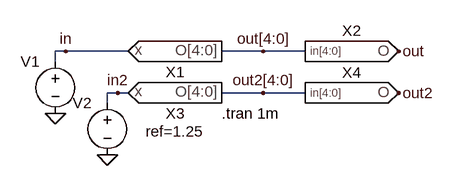
[diagram p0: schematic test-adc-5bit-fast.asc]
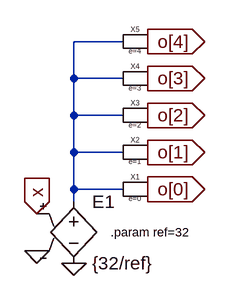
[diagram p1: sub-circuit adc-5bit-fast.asc]
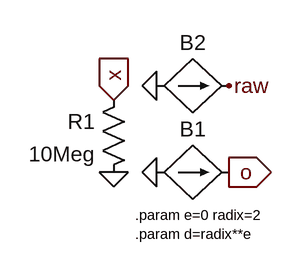
[diagram p2: sub-circuit adc_bit_extract.asc]
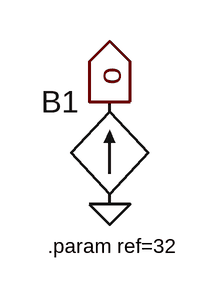
[diagram p3: sub-circuit dac-5bit-fast.asc]
test-adc-5bit-fast.asc, the LTspice schematic file:
Version 4
SHEET 1 880 680
WIRE 128 160 112 160
WIRE 224 160 128 160
WIRE 432 160 368 160
WIRE 496 160 432 160
WIRE 112 176 112 160
WIRE 208 224 192 224
WIRE 224 224 208 224
WIRE 432 224 368 224
WIRE 496 224 432 224
WIRE 192 240 192 224
FLAG 640 160 out
FLAG 128 160 in
FLAG 112 256 0
FLAG 640 224 out2
FLAG 432 160 out[4:0]
FLAG 432 224 out2[4:0]
FLAG 208 224 in2
FLAG 192 320 0
SYMBOL voltage 112 160 M0
WINDOW 3 24 96 Invisible 2
WINDOW 123 0 0 Left 0
WINDOW 39 0 0 Left 0
SYMATTR Value SINE(16 16 1k)
SYMATTR InstName V1
SYMBOL adc-5bit-fast 304 160 R0
SYMATTR InstName X1
SYMBOL adc-5bit-fast 304 224 R0
WINDOW 39 -8 44 Top 2
SYMATTR InstName X3
SYMATTR SpiceLine ref=1.25
SYMBOL dac-5bit-fast 560 160 R0
SYMATTR InstName X2
SYMBOL dac-5bit-fast 560 224 R0
SYMATTR InstName X4
SYMBOL voltage 192 224 M0
WINDOW 3 24 96 Invisible 2
WINDOW 123 0 0 Left 0
WINDOW 39 0 0 Left 0
SYMATTR Value SINE(0.625 0.625 1k)
SYMATTR InstName V2
TEXT 368 256 Left 2 !.tran 1m

adc-5bit-fast.asc, the sub-circuit schematic file:
Version 4
SHEET 1 880 680
WIRE 176 -224 112 -224
WIRE 112 -176 112 -224
WIRE 176 -176 112 -176
WIRE 112 -128 112 -176
WIRE 176 -128 112 -128
WIRE 112 -80 112 -128
WIRE 176 -80 112 -80
WIRE 112 -32 112 -80
WIRE 176 -32 112 -32
WIRE 112 -16 112 -32
FLAG 208 -32 o[0]
IOPIN 208 -32 Out
FLAG 64 0 x
IOPIN 64 0 In
FLAG 64 48 0
FLAG 112 64 0
FLAG 208 -80 o[1]
IOPIN 208 -80 Out
FLAG 208 -128 o[2]
IOPIN 208 -128 Out
FLAG 208 -176 o[3]
IOPIN 208 -176 Out
FLAG 208 -224 o[4]
IOPIN 208 -224 Out
SYMBOL adc_bit_extract 192 -32 R0
WINDOW 39 0 19 Bottom 0
SYMATTR InstName X1
SYMATTR SpiceLine e=0
SYMBOL e 112 -32 R0
SYMATTR InstName E1
SYMATTR Value {32/ref}
SYMBOL adc_bit_extract 192 -80 R0
WINDOW 39 0 19 Bottom 0
SYMATTR InstName X2
SYMATTR SpiceLine e=1
SYMBOL adc_bit_extract 192 -128 R0
WINDOW 39 0 19 Bottom 0
SYMATTR InstName X3
SYMATTR SpiceLine e=2
SYMBOL adc_bit_extract 192 -176 R0
WINDOW 39 0 19 Bottom 0
SYMATTR InstName X4
SYMATTR SpiceLine e=3
SYMBOL adc_bit_extract 192 -224 R0
WINDOW 39 0 19 Bottom 0
SYMATTR InstName X5
SYMATTR SpiceLine e=4
TEXT 160 24 Left 1 !.param ref=32

adc_bit_extract.asc, the sub-circuit schematic file:
Version 4
SHEET 1 880 680
FLAG 256 208 o
IOPIN 256 208 Out
FLAG 176 208 0
FLAG 128 208 0
FLAG 128 128 x
IOPIN 128 128 In
FLAG 256 112 raw
FLAG 176 112 0
SYMBOL bi 176 208 R270
WINDOW 0 32 40 VTop 2
WINDOW 3 -32 65 Invisible 2
SYMATTR InstName B1
SYMATTR Value I=V(raw)-int(V(raw)/radix)*radix
SYMATTR Value2 Rpar=1
SYMBOL res 144 112 M0
SYMATTR InstName R1
SYMATTR Value 10Meg
SYMBOL bi 176 112 R270
WINDOW 0 32 40 VTop 2
WINDOW 3 -32 65 Invisible 2
SYMATTR InstName B2
SYMATTR Value I=int(V(x)/d)
SYMATTR Value2 Rpar=1
TEXT 152 256 Left 1 !.param e=0 radix=2\n.param d=radix**e

dac-5bit-fast.asc, the sub-circuit schematic file:
Version 4
SHEET 1 880 680
FLAG 224 -48 o
IOPIN 224 -48 Out
FLAG 224 32 0
SYMBOL bi 224 32 R180
WINDOW 0 24 80 Left 2
WINDOW 3 24 0 Invisible 0
SYMATTR InstName B1
SYMATTR Value I=16*V(in[4])+8*V(in[3])+4*V(in[2])+2*V(in[1])+V(in[0])
SYMATTR Value2 Rpar={ref/32}
TEXT 176 64 Left 1 !.param ref=32

The netlist it stands for:
* test-adc-5bit-fast.asc
V1 in 0 SINE(16 16 1k)
XX1 in out[4] out[3] out[2] out[1] out[0] adc-5bit-fast
XX3 in2 out2[4] out2[3] out2[2] out2[1] out2[0] adc-5bit-fast params: ref=1.25
XX2 out[4] out[3] out[2] out[1] out[0] out dac-5bit-fast
XX4 out2[4] out2[3] out2[2] out2[1] out2[0] out2 dac-5bit-fast
V2 in2 0 SINE(0.625 0.625 1k)

* block symbol definitions
.subckt adc-5bit-fast x o[4] o[3] o[2] o[1] o[0]
XX1 o[0] N001 adc_bit_extract params: e=0
E1 N001 0 x 0 {32/ref}
XX2 o[1] N001 adc_bit_extract params: e=1
XX3 o[2] N001 adc_bit_extract params: e=2
XX4 o[3] N001 adc_bit_extract params: e=3
XX5 o[4] N001 adc_bit_extract params: e=4
.param ref=32
.ends adc-5bit-fast

.subckt adc_bit_extract o x
B1 0 o I=V(raw)-int(V(raw)/radix)*radix Rpar=1
R1 x 0 10Meg
B2 0 raw I=int(V(x)/d) Rpar=1
.param e=0 radix=2
.param d=radix**e
.ends adc_bit_extract

.subckt dac-5bit-fast in[4] in[3] in[2] in[1] in[0] o
B1 0 o I=16*V(in[4])+8*V(in[3])+4*V(in[2])+2*V(in[1])+V(in[0]) Rpar={ref/32}
.param ref=32
.ends dac-5bit-fast

.tran 1m
.backanno
.end